# Altium project EnviroSense.PrjPcb (part 2 of 2)

## Sheet WiFi Module.SchDoc: WiFi
size A4; SheetNumber: 5; SheetTotal: 7
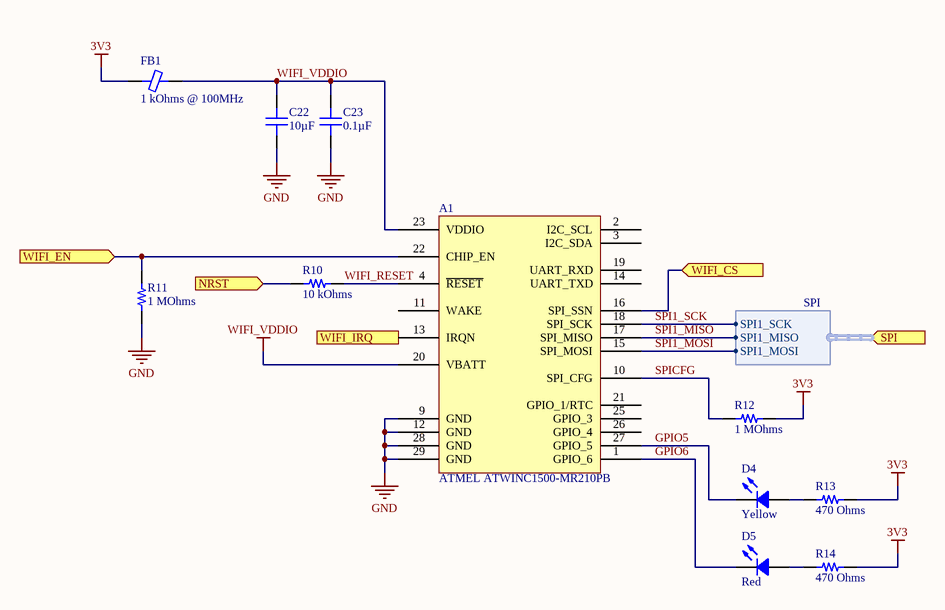
[diagram p4: WiFi Module.SchDoc]

### Parts
A1  ATMEL ATWINC1500-MR210PB  [ATMEL ATWINC1500-MR210PB]
C22  10µF  [CAP 0805_2012]
C23  0.1µF  [CAP 0603_1608]
D4  Yellow  [LED 1206_3216 YELLOW]
D5  Red  [LED 1206_3216 RED]
FB1  1 kOhms @ 100MHz  [FER 0805_2012]
R10  10 kOhms  [RES 0603_1608]
R11  1 MOhms  [RES 0603_1608]
R12  1 MOhms  [RES 0603_1608]
R13  470 Ohms  [RES 0603_1608]
R14  470 Ohms  [RES 0603_1608]

### Ports
NRST (in), SPI (in, harness SPI), WIFI_CS (in), WIFI_EN (in), WIFI_IRQ (out)

### Harnesses
SPI: SPI1_SCK, SPI1_MOSI, SPI1_MISO

### Nets
3V3: FB1.1 R12.2 R13.2 R14.2
GND: A1.9(GND) A1.12(GND) A1.28(GND) A1.29(GND) C22.1 C23.1 R11.1
WIFI_VDDIO: A1.20(VBATT) A1.23(VDDIO) C22.2 C23.2 FB1.2
GPIO5: A1.27(GPIO_5) D4.2
GPIO6: A1.1(GPIO_6) D5.2
NRST: R10.1 ; port NRST
SPI1_MISO: A1.17(SPI_MISO) ; port SPI.SPI1_MISO
SPI1_MOSI: A1.15(SPI_MOSI) ; port SPI.SPI1_MOSI
SPI1_SCK: A1.18(SPI_SCK) ; port SPI.SPI1_SCK
SPICFG: A1.10(SPI_CFG) R12.1
WIFI_CS: A1.16(SPI_SSN) ; port WIFI_CS
WIFI_EN: A1.22(CHIP_EN) R11.2 ; port WIFI_EN
WIFI_IRQ: A1.13(IRQN) ; port WIFI_IRQ
WIFI_RESET: A1.4(~{RESET}) R10.2
NetD4_1: D4.1 R13.1
NetD5_1: D5.1 R14.1

Not connected (* = marked no-connect by the designer): A1 2(I2C_SCL) 3(I2C_SDA) 11(WAKE) 14(UART_TXD) 19(UART_RXD) 21(GPIO_1/RTC) 25(GPIO_3) 26(GPIO_4)

### Notes on the sheet
- Title
- Size:
- Date:
- A4
- Number:
- Time:
- Revision:
- Sheet
- of
- File:

### Library data of the parts
A1 = ATMEL ATWINC1500-MR210PB: System: Connector
C22 = CL21A106KPCLQNC: CAP CER 10UF 10V X5R 0805; Manufacturer: Samsung Electro-Mechanics; Tolerance: ±10%; Part Number: CL21A106KPCLQNC; Value: 10µF; Applications: General Purpose; Capacitance: 10µF; ComponentLink1Description: Datasheet; ComponentLink1URL: http://www.samsungsem.com/kr/support/product-search/mlcc/CL21A106KPCLQNC.jsp; ComponentLink2Description: DigiKey Link; ComponentLink2URL: http://digikey.com/product-detail/en/samsung-electro-mechanics/CL21A106KPCLQNC/1276-2402-1-ND/3890488; Device Package: 0805 (2012 Metric); LastUpdated: 02/09/2020 01:04:19; Lifecycle Status: Active; Minimum Order: 1; Mounting Type: Surface Mount, MLCC; Operating Temperature: -55°C ~ 85°C; Package / Case: 0805 (2012 Metric); Packaging: TapeAndReel; PartId: 14319; Part Status: Active; Price: 0.03; Series: CL; Size / Dimension: 0.079" L x 0.049" W (2.00mm x 1.25mm); Supplier 1: DigiKey; Supplier Part Number 1: 1276-2402-1-ND; Temperature Coefficient: X5R; Thickness (Max): 0.037" (0.95mm); Voltage - Rated: 10V
C23 = 06035C104JAT4A: CAP CER 0.1UF 50V X7R 0603; Manufacturer: AVX Corporation; Tolerance: ±5%; Part Number: 06035C104JAT4A; Value: 0.1µF; Applications: General Purpose; Capacitance: 0.1µF; ComponentLink1Description: Datasheet; ComponentLink1URL: http://datasheets.avx.com/X7RDielectric.pdf; ComponentLink2Description: DigiKey Link; ComponentLink2URL: http://digikey.com/product-detail/en/avx-corporation/06035C104JAT4A/478-12459-1-ND/9749311; Device Package: 0603 (1608 Metric); LastUpdated: 02/09/2020 01:03:34; Lifecycle Status: Active; Minimum Order: 1; Mounting Type: Surface Mount, MLCC; Operating Temperature: -55°C ~ 125°C; Package / Case: 0603 (1608 Metric); Packaging: TapeAndReel; PartId: 3002; Part Status: Active; Price: 0.01; Series: -; Size / Dimension: 0.063" L x 0.032" W (1.60mm x 0.81mm); Supplier 1: DigiKey; Supplier Part Number 1: 478-12459-1-ND; Temperature Coefficient: X7R; Thickness (Max): 0.035" (0.90mm); Voltage - Rated: 50V
D4 = AP3216SYCK: LED YELLOW CLEAR SMD; Manufacturer: Kingbright; Configuration: Standard; Current - Test: 20mA; Lens Color: Colorless; Lens Size: 2.00mm x 1.60mm; Lens Style: Rectangle with Flat Top; Millicandela Rating: 150mcd; Viewing Angle: 120°; Voltage - Forward (Vf) (Typ): 2V; Wavelength - Dominant: 590nm; Part Number: AP3216SYCK; Color: Yellow; ComponentLink1Description: Datasheet; ComponentLink1URL: http://www.kingbrightusa.com/images/catalog/SPEC/AP3216SYCK.pdf; ComponentLink2Description: DigiKey Link; ComponentLink2URL: http://digikey.com/product-detail/en/kingbright/AP3216SYCK/754-2163-1-ND/7708878; Device Package: 1206 (3216 Metric); Height (Max): 1.10mm; LastUpdated: 02/09/2020 01:21:26; Lens Transparency: Clear; Lifecycle Status: Active; Minimum Order: 1; Mounting Type: Surface Mount; Package / Case: 1206 (3216 Metric); Packaging: TapeAndReel; PartId: 5; Part Status: Active; Price: 0.07; Series: -; Size / Dimension: 3.20mm L x 1.60mm W; Supplier 1: DigiKey; Supplier Part Number 1: 754-2163-1-ND; Supplier Device Package: SMD; Value: Yellow; Wavelength - Peak: 590nm
D5 = LTST-C21KRKT: LED RED CLEAR CHIP SMD; Manufacturer: Lite-On Inc.; Configuration: Standard; Current - Test: 20mA; Lens Color: Colorless; Lens Style: Round with Flat Top; Millicandela Rating: 100mcd; Viewing Angle: 70°; Voltage - Forward (Vf) (Typ): 2V; Wavelength - Dominant: 631nm; Wavelength - Peak: 639nm; Part Number: LTST-C21KRKT; Color: Red; ComponentLink1Description: Datasheet; ComponentLink1URL: http://optoelectronics.liteon.com/upload/download/DS22-2006-020/LTST-C21KRKT.pdf; ComponentLink2Description: DigiKey Link; ComponentLink2URL: http://digikey.com/product-detail/en/lite-on-inc/LTST-C21KRKT/160-2024-1-ND/3711415; Device Package: 1206 (3216 Metric); Height (Max): 1.10mm; LastUpdated: 02/09/2020 01:21:09; Lens Transparency: Clear; Lifecycle Status: Active; Minimum Order: 1; Mounting Type: Surface Mount; Package / Case: 1206 (3216 Metric); Packaging: TapeAndReel; PartId: 187; Part Status: Active; Price: 0.07; Series: -; Size / Dimension: 3.20mm L x 1.60mm W; Supplier 1: DigiKey; Supplier Part Number 1: 160-2024-1-ND; Supplier Device Package: Chip LED; Value: Red
FB1 = PE-0805FB102ST: FERRITE BEAD 1 KOHM 0805 1LN; Manufacturer: Pulse Electronics Network; Current Rating (Max): 500mA; DC Resistance (DCR) (Max): 400mOhm; Filter Type: Signal Line; Number of Lines: 1; Part Number: PE-0805FB102ST; ComponentLink1Description: Datasheet; ComponentLink1URL: https://productfinder.pulseeng.com/doc_type/WEB301/doc_num/WC706/doc_part/WC706.pdf; ComponentLink2Description: DigiKey Link; ComponentLink2URL: http://digikey.com/product-detail/en/pulse-electronics-network/PE-0805FB102ST/553-2390-1-ND/5050589; Device Package: 0805 (2012 Metric); Height (Max): 0.041" (1.05mm); Impedance @ Frequency: 1 kOhms @ 100MHz; LastUpdated: 02/09/2020 01:18:21; Lifecycle Status: Active; Minimum Order: 1; Mounting Type: Surface Mount; Operating Temperature: -40°C ~ 105°C; Package / Case: 0805 (2012 Metric); Packaging: TapeAndReel; PartId: 1549; Part Status: Active; Price: 0.02; Series: FB; Size / Dimension: 0.079" L x 0.049" W (2.00mm x 1.25mm); Supplier 1: DigiKey; Supplier Part Number 1: 553-2390-1-ND; Value: 1 kOhms @ 100MHz
R10 = ERJ-PA3J103V: RES SMD 10K OHM 5% 1/4W 0603; Manufacturer: Panasonic Electronic Components; Power (Watts): 0.25W, 1/4W; Temperature Coefficient: ±200ppm/°C; Part Number: ERJ-PA3J103V; Value: 10 kOhms; ComponentLink1Description: Datasheet; ComponentLink1URL: https://industrial.panasonic.com/cdbs/www-data/pdf/RDO0000/AOA0000C331.pdf; ComponentLink2Description: DigiKey Link; ComponentLink2URL: http://digikey.com/product-detail/en/panasonic-electronic-components/ERJ-PA3J103V/P10KBZCT-ND/5036237; Composition: Thick Film; Device Package: 0603 (1608 Metric); Features: Automotive AEC-Q200, Pulse Withstanding; Height - Seated (Max): 0.022" (0.55mm); LastUpdated: 02/09/2020 01:10:16; Lifecycle Status: Active; Minimum Order: 1; Number of Terminations: 2; Operating Temperature: -55°C ~ 155°C; Package / Case: 0603 (1608 Metric); Packaging: TapeAndReel; PartId: 8965; Part Status: Active; Price: 0.01; Ratings: AEC-Q200; Resistance: 10 kOhms; Series: ERJ; Size / Dimension: 0.063" L x 0.031" W (1.60mm x 0.80mm); Supplier 1: DigiKey; Supplier Part Number 1: P10KBZCT-ND; Supplier Device Package: 0603; Tolerance: ±5%
R11 R12 = ERJ-PA3J105V: RES SMD 1M OHM 5% 1/4W 0603; Manufacturer: Panasonic Electronic Components; Power (Watts): 0.25W, 1/4W; Temperature Coefficient: ±200ppm/°C; Part Number: ERJ-PA3J105V; Value: 1 MOhms; ComponentLink1Description: Datasheet; ComponentLink1URL: https://industrial.panasonic.com/cdbs/www-data/pdf/RDO0000/AOA0000C331.pdf; ComponentLink2Description: DigiKey Link; ComponentLink2URL: http://digikey.com/product-detail/en/panasonic-electronic-components/ERJ-PA3J105V/P1MBZCT-ND/5036239; Composition: Thick Film; Device Package: 0603 (1608 Metric); Features: Automotive AEC-Q200, Pulse Withstanding; Height - Seated (Max): 0.022" (0.55mm); LastUpdated: 02/09/2020 01:09:51; Lifecycle Status: Active; Minimum Order: 1; Number of Terminations: 2; Operating Temperature: -55°C ~ 155°C; Package / Case: 0603 (1608 Metric); Packaging: TapeAndReel; PartId: 20407; Part Status: Active; Price: 0.01; Ratings: AEC-Q200; Resistance: 1 MOhms; Series: ERJ; Size / Dimension: 0.063" L x 0.031" W (1.60mm x 0.80mm); Supplier 1: DigiKey; Supplier Part Number 1: P1MBZCT-ND; Supplier Device Package: 0603; Tolerance: ±5%
R13 R14 = CRGCQ0603J470R: CRGCQ 0603 470R 5%; Manufacturer: TE Connectivity Passive Product; Power (Watts): 0.1W, 1/10W; Temperature Coefficient: ±100ppm/°C; Part Number: CRGCQ0603J470R; Value: 470 Ohms; ComponentLink1Description: Datasheet; ComponentLink1URL: https://www.te.com/commerce/DocumentDelivery/DDEController?Action=srchrtrv&DocNm=1773204-3&DocType=DS&DocLang=English; ComponentLink2Description: DigiKey Link; ComponentLink2URL: http://digikey.com/product-detail/en/te-connectivity-passive-product/CRGCQ0603J470R/A130089CT-ND/8577921; Composition: Thick Film; Device Package: 0603 (1608 Metric); Features: Automotive AEC-Q200, Moisture Resistant; Height - Seated (Max): 0.022" (0.55mm); LastUpdated: 02/09/2020 01:09:31; Lifecycle Status: Active; Minimum Order: 1; Number of Terminations: 2; Operating Temperature: -55°C ~ 155°C; Package / Case: 0603 (1608 Metric); Packaging: CutTape; PartId: 25681; Part Status: Active; Price: 0.10; Ratings: AEC-Q200; Resistance: 470 Ohms; Series: CRGCQ; Size / Dimension: 0.063" L x 0.031" W (1.60mm x 0.80mm); Supplier 1: DigiKey; Supplier Part Number 1: A130089CT-ND; Supplier Device Package: 0603; Tolerance: ±5%

## Sheet Environmental Sensor.SchDoc: Environmental Sensor
size A4; SheetNumber: 3; SheetTotal: 7
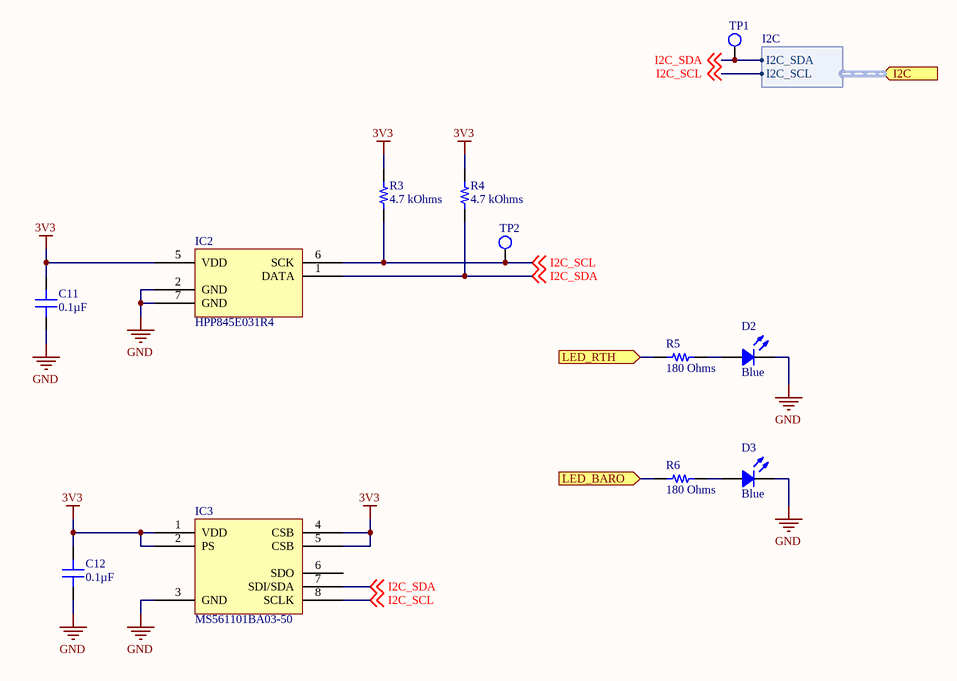
[diagram p5: Environmental Sensor.SchDoc]

### Parts
C11  0.1µF  [CAP 0603_1608]
C12  0.1µF  [CAP 0603_1608]
D2  Blue  [LED 1206_3216 BLUE]
D3  Blue  [LED 1206_3216 BLUE]
IC2  HPP845E031R4  [TE HPP845E031R4]
IC3  MS561101BA03-50  [MEAS SPEC MS5611-01BA03]
R3  4.7 kOhms  [RES 0603_1608]
R4  4.7 kOhms  [RES 0603_1608]
R5  180 Ohms  [RES 0603_1608]
R6  180 Ohms  [RES 0603_1608]
TP1  Test Point  [TestPoint-1.5mm]  (value not drawn)  (no BOM)
TP2  Test Point  [TestPoint-1.5mm]  (value not drawn)  (no BOM)

### Ports
I2C (in, harness I2C), LED_BARO (in), LED_RTH (in)

### Harnesses
I2C: I2C_SDA, I2C_SCL

### Nets
3V3: C11.2 C12.2 IC2.5(VDD) IC3.1(VDD) IC3.2(PS) IC3.4(CSB) IC3.5(CSB) R3.2 R4.2
GND: C11.1 C12.1 D2.2 D3.2 IC2.2(GND) IC2.7(GND) IC3.3(GND)
I2C_SCL: IC2.6(SCK) IC3.8(SCLK) R3.1 TP2.1(TP) ; off-sheet I2C_SCL, port I2C.I2C_SCL
I2C_SDA: IC2.1(DATA) IC3.7(SDI/SDA) R4.1 TP1.1(TP) ; off-sheet I2C_SDA, port I2C.I2C_SDA
LED_BARO: R6.1 ; port LED_BARO
LED_RTH: R5.1 ; port LED_RTH
NetD2_1: D2.1 R5.2
NetD3_1: D3.1 R6.2

Not connected (* = marked no-connect by the designer): IC3 6(SDO)

### Notes on the sheet
- Title
- Size:
- Date:
- A4
- Number:
- Time:
- Revision:
- Sheet
- of
- File:

### Library data of the parts
C11 C12 = 06035C104JAT4A: as C23 on sheet WiFi Module; Part Number: 06035C104JAT4A; Value: 0.1µF; Applications: General Purpose; Capacitance: 0.1µF; ComponentLink1Description: Datasheet; ComponentLink1URL: http://datasheets.avx.com/X7RDielectric.pdf; ComponentLink2Description: DigiKey Link; ComponentLink2URL: http://digikey.com/product-detail/en/avx-corporation/06035C104JAT4A/478-12459-1-ND/9749311; Device Package: 0603 (1608 Metric); LastUpdated: 02/09/2020 01:03:34; Lifecycle Status: Active; Minimum Order: 1; Mounting Type: Surface Mount, MLCC; Operating Temperature: -55°C ~ 125°C; Package / Case: 0603 (1608 Metric); Packaging: TapeAndReel; PartId: 3002; Part Status: Active; Price: 0.01; Series: -; Size / Dimension: 0.063" L x 0.032" W (1.60mm x 0.81mm); Supplier 1: DigiKey; Supplier Part Number 1: 478-12459-1-ND; Temperature Coefficient: X7R; Thickness (Max): 0.035" (0.90mm); Voltage - Rated: 50V
D2 D3 = BL-HB333Q-AV-TRB: 1206 0.5MM BLUE WATER CLEAR SMT; Manufacturer: American Bright Optoelectronics Corporation; Configuration: Standard; Current - Test: 5mA; Lens Color: Colorless; Lens Size: 2.00mm x 1.50mm; Lens Style: Rectangle with Flat Top; Millicandela Rating: 15mcd; Viewing Angle: 120°; Voltage - Forward (Vf) (Typ): 2.8V; Wavelength - Peak: 460nm; Part Number: BL-HB333Q-AV-TRB; Color: Blue; ComponentLink1Description: Datasheet; ComponentLink1URL: //media.digikey.com/pdf/Data%20Sheets/American%20Bright%20Opto%20PDFs/BL-HB333Q-AV-TRB_V1.0_9-29-09.pdf; ComponentLink2Description: DigiKey Link; ComponentLink2URL: http://digikey.com/product-detail/en/american-bright-optoelectronics-corporation/BL-HB333Q-AV-TRB/2007-BL-HB333Q-AV-TRBCT-ND/9924239; Device Package: 1206 (3216 Metric); Height (Max): 0.55mm; LastUpdated: 02/09/2020 01:20:33; Lens Transparency: Clear; Lifecycle Status: Active; Minimum Order: 1; Mounting Type: Surface Mount; Package / Case: 1206 (3216 Metric); Packaging: TapeAndReel; PartId: 746; Part Status: Active; Price: 0.09; Series: -; Size / Dimension: 3.20mm L x 1.60mm W; Supplier 1: DigiKey; Supplier Part Number 1: 2007-BL-HB333Q-AV-TRBCT-ND; Supplier Device Package: 1206; Value: Blue
IC2 = HPP845E031R4: SENSOR HUMID/TEMP 3V I2C 2% SMD; Manufacturer: TE Connectivity Measurement Specialties; Accuracy: ±2% RH; Humidity Range: 0 ~ 100% RH; Output: 12b; Output Type: I²C; Response Time: 5s; Sensor Type: Humidity, Temperature; Voltage - Supply: 1.5V ~ 3.6V; Part Number: HPP845E031R4; ComponentLink1Description: Datasheet; ComponentLink1URL: https://www.te.com/commerce/DocumentDelivery/DDEController?Action=srchrtrv&DocNm=HPC199_6&DocType=Data+Sheet&DocLang=English; ComponentLink2Description: DigiKey Link; ComponentLink2URL: http://digikey.com/product-detail/en/te-connectivity-measurement-specialties/HPP845E031R4/223-1144-1-ND/3945773; Device Package: 6-VDFN Exposed Pad; LastUpdated: 24/05/2020 22:55:13; Lifecycle Status: Active; Minimum Order: 1; Mounting Type: Surface Mount; Operating Temperature: -40°C ~ 125°C; Package / Case: 6-VDFN Exposed Pad; Packaging: TapeAndReel; Part Status: Active; Price: 2.87; Series: HTU; Supplier 1: DigiKey; Supplier Part Number 1: 223-1144-1-ND; Supplier Device Package: 6-DFN (3x3)
IC3 = MS561101BA03-50: BAROMETRIC PRESSURE SENSOR; Manufacturer: TE Connectivity Measurement Specialties; Accuracy: ±0.022PSI (±0.15kPa); Maximum Pressure: 87.02PSI (600kPa); Operating Pressure: 0.15PSI ~ 17.4PSI (1kPa ~ 120kPa); Output: 24 b; Output Type: I²C, SPI; Port Style: No Port; Pressure Type: Absolute; Voltage - Supply: 1.8V ~ 3.6V; Part Number: MS561101BA03-50; Applications: Board Mount; ComponentLink1Description: Datasheet; ComponentLink1URL: https://www.te.com/commerce/DocumentDelivery/DDEController?Action=srchrtrv&DocNm=MS5611-01BA03&DocType=Data+Sheet&DocLang=English; ComponentLink2Description: DigiKey Link; ComponentLink2URL: http://digikey.com/product-detail/en/te-connectivity-measurement-specialties/MS561101BA03-50/223-1622-1-ND/5277638; Device Package: 8-SMD; LastUpdated: 20/04/2020 15:54:53; Lifecycle Status: Active; Minimum Order: 1; Operating Temperature: -40°C ~ 85°C; Package / Case: 8-SMD; Packaging: Unknown; Part Status: Active; Price: 6.37; Series: -; Supplier 1: DigiKey; Supplier Part Number 1: 223-1622-1-ND; Termination Style: SMD (SMT) Tab
R3 R4 = ERJ-3EKF4701V: RES SMD 4.7K OHM 1% 1/10W 0603; Manufacturer: Panasonic Electronic Components; Power (Watts): 0.1W, 1/10W; Temperature Coefficient: ±100ppm/°C; Part Number: ERJ-3EKF4701V; Value: 4.7 kOhms; ComponentLink1Description: Datasheet; ComponentLink1URL: https://industrial.panasonic.com/cdbs/www-data/pdf/RDA0000/AOA0000C304.pdf; ComponentLink2Description: DigiKey Link; ComponentLink2URL: http://digikey.com/product-detail/en/panasonic-electronic-components/ERJ-3EKF4701V/P4.70KHCT-ND/1746782; Composition: Thick Film; Device Package: 0603 (1608 Metric); Features: Automotive AEC-Q200; Height - Seated (Max): 0.022" (0.55mm); LastUpdated: 02/09/2020 01:10:23; Lifecycle Status: Active; Minimum Order: 1; Number of Terminations: 2; Operating Temperature: -55°C ~ 155°C; Package / Case: 0603 (1608 Metric); Packaging: TapeAndReel; PartId: 5645; Part Status: Active; Price: 0.01; Ratings: AEC-Q200; Resistance: 4.7 kOhms; Series: ERJ; Size / Dimension: 0.063" L x 0.031" W (1.60mm x 0.80mm); Supplier 1: DigiKey; Supplier Part Number 1: P4.70KHCT-ND; Supplier Device Package: 0603; Tolerance: ±1%
R5 R6 = ERJ-PA3J181V: RES SMD 180 OHM 5% 1/4W 0603; Manufacturer: Panasonic Electronic Components; Power (Watts): 0.25W, 1/4W; Temperature Coefficient: ±200ppm/°C; Part Number: ERJ-PA3J181V; Value: 180 Ohms; ComponentLink1Description: Datasheet; ComponentLink1URL: https://industrial.panasonic.com/cdbs/www-data/pdf/RDO0000/AOA0000C331.pdf; ComponentLink2Description: DigiKey Link; ComponentLink2URL: http://digikey.com/product-detail/en/panasonic-electronic-components/ERJ-PA3J181V/P180BZCT-ND/5036266; Composition: Thick Film; Device Package: 0603 (1608 Metric); Features: Automotive AEC-Q200, Pulse Withstanding; Height - Seated (Max): 0.022" (0.55mm); LastUpdated: 02/09/2020 01:09:49; Lifecycle Status: Active; Minimum Order: 1; Number of Terminations: 2; Operating Temperature: -55°C ~ 155°C; Package / Case: 0603 (1608 Metric); Packaging: TapeAndReel; PartId: 21551; Part Status: Active; Price: 0.01; Ratings: AEC-Q200; Resistance: 180 Ohms; Series: ERJ; Size / Dimension: 0.063" L x 0.031" W (1.60mm x 0.80mm); Supplier 1: DigiKey; Supplier Part Number 1: P180BZCT-ND; Supplier Device Package: 0603; Tolerance: ±5%

## Sheet Display Module.SchDoc: Display
size A4; SheetNumber: 1; SheetTotal: 7
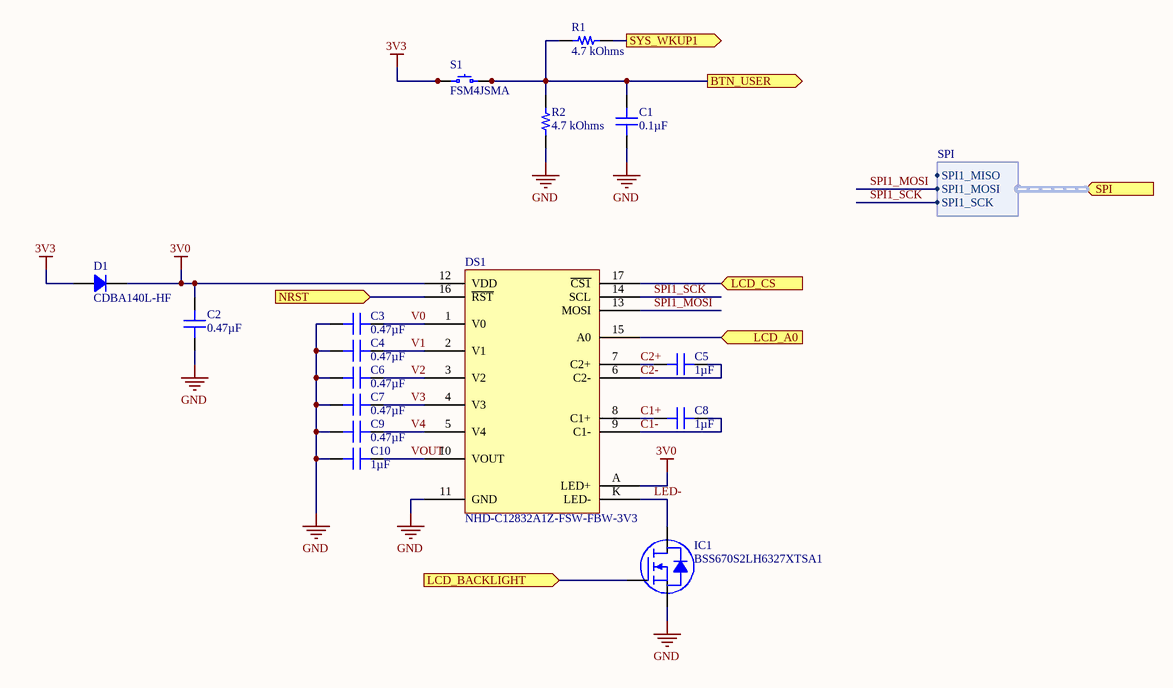
[diagram p6: Display Module.SchDoc]

### Parts
C1  0.1µF  [CAP 0603_1608]
C2  0.47µF  [CAP 0603_1608]
C3  0.47µF  [CAP 0603_1608]
C4  0.47µF  [CAP 0603_1608]
C5  1µF  [CAP 0603_1608]
C6  0.47µF  [CAP 0603_1608]
C7  0.47µF  [CAP 0603_1608]
C8  1µF  [CAP 0603_1608]
C9  0.47µF  [CAP 0603_1608]
C10  1µF  [CAP 0603_1608]
D1  CDBA140L-HF  [DO214AC SMA]
DS1  NHD-C12832A1Z-FSW-FBW-3V3  [NHD-C12832A1Z WHITE]
IC1  BSS670S2LH6327XTSA1  [INFINEON SOT-23-3]
R1  4.7 kOhms  [RES 0603_1608]
R2  4.7 kOhms  [RES 0603_1608]
S1  FSM4JSMA  [TE FSM4JSMA]

### Ports
BTN_USER (out), LCD_A0 (in), LCD_BACKLIGHT (in), LCD_CS (in), NRST (in), SPI (in, harness SPI), SYS_WKUP1 (out)

### Harnesses
SPI: SPI1_MISO, SPI1_MOSI, SPI1_SCK

### Nets
3V0: C2.1 D1.2 DS1.12(VDD) DS1.A(LED+)
3V3: D1.1 S1.1 S1.2
GND: C1.1 C2.2 C3.2 C4.2 C6.2 C7.2 C9.2 C10.1 DS1.11(GND) IC1.2(S) R2.1
BTN_USER: C1.2 R1.2 R2.2 S1.3 S1.4 ; port BTN_USER
C1+: C8.1 DS1.8(C1+)
C1-: C8.2 DS1.9(C1-)
C2+: C5.1 DS1.7(C2+)
C2-: C5.2 DS1.6(C2-)
LCD_A0: DS1.15(A0) ; port LCD_A0
LCD_BACKLIGHT: IC1.1(G) ; port LCD_BACKLIGHT
LCD_CS: DS1.17(~{CS1}) ; port LCD_CS
LED-: DS1.K(LED-) IC1.3(D)
NRST: DS1.16(~{RST}) ; port NRST
SPI1_MOSI: DS1.13(MOSI) ; port SPI.SPI1_MOSI
SPI1_SCK: DS1.14(SCL) ; port SPI.SPI1_SCK
SYS_WKUP1: R1.1 ; port SYS_WKUP1
V0: C3.1 DS1.1(V0)
V1: C4.1 DS1.2(V1)
V2: C6.1 DS1.3(V2)
V3: C7.1 DS1.4(V3)
V4: C9.1 DS1.5(V4)
VOUT: C10.2 DS1.10(VOUT)

### Notes on the sheet
- Title
- Size:
- Date:
- A4
- Number:
- Time:
- Revision:
- Sheet
- of
- File:

### Library data of the parts
C1 = 06035C104JAT4A: as C23 on sheet WiFi Module; Part Number: 06035C104JAT4A; Value: 0.1µF; Applications: General Purpose; Capacitance: 0.1µF; ComponentLink1Description: Datasheet; ComponentLink1URL: http://datasheets.avx.com/X7RDielectric.pdf; ComponentLink2Description: DigiKey Link; ComponentLink2URL: http://digikey.com/product-detail/en/avx-corporation/06035C104JAT4A/478-12459-1-ND/9749311; Device Package: 0603 (1608 Metric); LastUpdated: 02/09/2020 01:03:34; Lifecycle Status: Active; Minimum Order: 1; Mounting Type: Surface Mount, MLCC; Operating Temperature: -55°C ~ 125°C; Package / Case: 0603 (1608 Metric); Packaging: TapeAndReel; PartId: 3002; Part Status: Active; Price: 0.01; Series: -; Size / Dimension: 0.063" L x 0.032" W (1.60mm x 0.81mm); Supplier 1: DigiKey; Supplier Part Number 1: 478-12459-1-ND; Temperature Coefficient: X7R; Thickness (Max): 0.035" (0.90mm); Voltage - Rated: 50V
C2-C4 C6 C7 C9 = 0603B474K100CT: CAP CER 0.47UF 10V X7R 0603; Manufacturer: Walsin Technology Corporation; Tolerance: ±10%; Part Number: 0603B474K100CT; Value: 0.47µF; Applications: General Purpose; Capacitance: 0.47µF; ComponentLink1Description: Datasheet; ComponentLink1URL: http://www.passivecomponent.com/wp-content/uploads/2018/10/MLCC.pdf; ComponentLink2Description: DigiKey Link; ComponentLink2URL: http://digikey.com/product-detail/en/walsin-technology-corporation/0603B474K100CT/1292-1450-1-ND/9355454; Device Package: 0603 (1608 Metric); LastUpdated: 02/09/2020 01:03:16; Lifecycle Status: Active; Minimum Order: 1; Mounting Type: Surface Mount, MLCC; Operating Temperature: -55°C ~ 125°C; Package / Case: 0603 (1608 Metric); Packaging: TapeAndReel; PartId: 13392; Part Status: Active; Price: 0.01; Series: -; Size / Dimension: 0.063" L x 0.031" W (1.60mm x 0.80mm); Supplier 1: DigiKey; Supplier Part Number 1: 1292-1450-1-ND; Temperature Coefficient: X7R; Thickness (Max): 0.037" (0.95mm); Voltage - Rated: 10V
C5 C8 C10 = LMK107B7105KA-T: CAP CER 1UF 10V X7R 0603; Manufacturer: Taiyo Yuden; Tolerance: ±10%; Part Number: LMK107B7105KA-T; Value: 1µF; Applications: General Purpose; Capacitance: 1µF; ComponentLink1Description: Datasheet; ComponentLink1URL: https://www.yuden.co.jp/productdata/catalog/mlcc01_e.pdf; ComponentLink2Description: DigiKey Link; ComponentLink2URL: http://digikey.com/product-detail/en/taiyo-yuden/LMK107B7105KA-T/587-1242-1-ND/931019; Device Package: 0603 (1608 Metric); LastUpdated: 02/09/2020 01:03:30; Lifecycle Status: Active; Minimum Order: 1; Mounting Type: Surface Mount, MLCC; Operating Temperature: -55°C ~ 125°C; Package / Case: 0603 (1608 Metric); Packaging: TapeAndReel; PartId: 5525; Part Status: Active; Price: 0.01; Series: M; Size / Dimension: 0.063" L x 0.031" W (1.60mm x 0.80mm); Supplier 1: DigiKey; Supplier Part Number 1: 587-1242-1-ND; Temperature Coefficient: X7R; Thickness (Max): 0.035" (0.90mm); Voltage - Rated: 10V
D1 = CDBA140L-HF: DIODE SCHOTTKY 40V 1A DO214AC; Manufacturer: Comchip Technology; Capacitance @ Vr, F: 130pF @ 4V, 1MHz; Current - Reverse Leakage @ Vr: 1mA @ 40V; Speed: Fast Recovery =< 500ns, > 200mA (Io); Voltage - Forward (Vf) (Max) @ If: 400mV @ 1A; Part Number: CDBA140L-HF; ComponentLink1Description: Datasheet; ComponentLink1URL: http://www.comchiptech.com/admin/files/product/CDBA140L-HF RevC513944.pdf; ComponentLink2Description: DigiKey Link; ComponentLink2URL: http://digikey.com/product-detail/en/comchip-technology/CDBA140L-HF/641-1691-1-ND/5226074; Current - Average Rectified (Io): 1A; Diode Type: Schottky; LastUpdated: 02/09/2020 01:19:02; Lifecycle Status: Active; Minimum Order: 1; Mounting Type: Surface Mount; Operating Temperature - Junction: -50°C ~ 100°C; Package / Case: DO-214AC, SMA; Packaging: TapeAndReel; PartId: 2148; Part Status: Active; Price: 0.10; Series: -; Supplier 1: DigiKey; Supplier Part Number 1: 641-1691-1-ND; Supplier Device Package: DO-214AC (SMA); Voltage - DC Reverse (Vr) (Max): 40V
DS1 = NHD-C12832A1Z-FSW-FBW-3V3: LCD COG GRAPHIC 128X32; Manufacturer: Newhaven Display Intl; Background Color: White (Black - Inverted); Backlight: LED - White; Display Mode: Transflective; Display Type: FSTN - Film Super-Twisted Nematic; Interface: SPI; Viewing Area: 36.00mm W x 12.00mm H; Part Number: NHD-C12832A1Z-FSW-FBW-3V3; ComponentLink1Description: Datasheet; ComponentLink1URL: http://www.newhavendisplay.com/specs/NHD-C12832A1Z-FSW-FBW-3V3.pdf; ComponentLink2Description: DigiKey Link; ComponentLink2URL: //digikey.com/product-detail/en/newhaven-display-intl/NHD-C12832A1Z-FSW-FBW-3V3/NHD-C12832A1Z-FSW-FBW-3V3-ND/2059236; LastUpdated: 04/12/2019 12:49:03; Lifecycle Status: 0; Minimum Order: 1; Packaging: Unknown; PartId: 1; Part Status: Active; Price: 11.53; Series: -; Supplier 1: DigiKey; Supplier Part Number 1: NHD-C12832A1Z-FSW-FBW-3V3-ND
IC1 = BSS670S2LH6327XTSA1: MOSFET N-CH 55V 540MA SOT23; Manufacturer: Infineon Technologies; Current - Continuous Drain (Id) @ 25°C: 540mA (Ta); Drive Voltage (Max Rds On,  Min Rds On): 4.5V, 10V; FET Type: N-Channel; Gate Charge (Qg) (Max) @ Vgs: 2.26nC @ 10V; Input Capacitance (Ciss) (Max) @ Vds: 75pF @ 25V; Power Dissipation (Max): 360mW (Ta); Rds On (Max) @ Id, Vgs: 650mOhm @ 270mA, 10V; Vgs (Max): ±20V; Vgs(th) (Max) @ Id: 2V @ 2.7µA; Part Number: BSS670S2LH6327XTSA1; ComponentLink1Description: Datasheet; ComponentLink1URL: https://www.infineon.com/dgdl/BSS670S2L_Rev2.5.pdf?folderId=db3a3043156fd573011622e10b5c1f67&fileId=db3a304330f68606013109e4a7fb0094; ComponentLink2Description: DigiKey Link; ComponentLink2URL: http://digikey.com/product-detail/en/infineon-technologies/BSS670S2LH6327XTSA1/BSS670S2LH6327XTSA1CT-ND/3196653; Drain to Source Voltage (Vdss): 55V; LastUpdated: 02/09/2020 01:25:05; Lifecycle Status: Active; Minimum Order: 1; Mounting Type: Surface Mount; Operating Temperature: -55°C ~ 150°C (TJ); Package / Case: TO-236-3, SC-59, SOT-23-3; Packaging: TapeAndReel; Part Status: Active; Price: 0.07; Series: OptiMOS™; Supplier 1: DigiKey; Supplier Part Number 1: BSS670S2LH6327XTSA1CT-ND; Supplier Device Package: SOT-23-3; Technology: MOSFET (Metal Oxide)
R1 R2 = ERJ-3EKF4701V: as R3 on sheet Environmental Sensor; Part Number: ERJ-3EKF4701V; Value: 4.7 kOhms; ComponentLink1Description: Datasheet; ComponentLink1URL: https://industrial.panasonic.com/cdbs/www-data/pdf/RDA0000/AOA0000C304.pdf; ComponentLink2Description: DigiKey Link; ComponentLink2URL: http://digikey.com/product-detail/en/panasonic-electronic-components/ERJ-3EKF4701V/P4.70KHCT-ND/1746782; Composition: Thick Film; Device Package: 0603 (1608 Metric); Features: Automotive AEC-Q200; Height - Seated (Max): 0.022" (0.55mm); LastUpdated: 02/09/2020 01:10:23; Lifecycle Status: Active; Minimum Order: 1; Number of Terminations: 2; Operating Temperature: -55°C ~ 155°C; Package / Case: 0603 (1608 Metric); Packaging: TapeAndReel; PartId: 5645; Part Status: Active; Price: 0.01; Ratings: AEC-Q200; Resistance: 4.7 kOhms; Series: ERJ; Size / Dimension: 0.063" L x 0.031" W (1.60mm x 0.80mm); Supplier 1: DigiKey; Supplier Part Number 1: P4.70KHCT-ND; Supplier Device Package: 0603; Tolerance: ±1%
S1 = FSM4JSMA: SWITCH TACTILE SPST-NO 0.05A 24V; Manufacturer: TE Connectivity ALCOSWITCH Switches; Actuator Height off PCB, Vertical: 5.00mm; Actuator Orientation: Top Actuated; Actuator Type: Standard; Contact Rating @ Voltage: 0.05A @ 24VDC; Illumination: Non-Illuminated; Operating Force: 160gf; Outline: 6.00mm x 6.00mm; Switch Function: Off-Mom; Part Number: FSM4JSMA; Circuit: SPST-NO; ComponentLink1Description: Datasheet; ComponentLink1URL: https://www.te.com/commerce/DocumentDelivery/DDEController?Action=srchrtrv&DocNm=1308111-1_SWITCHES_CORE_PROGRAM_CATALOG&DocType=CS&DocLang=English; ComponentLink2Description: DigiKey Link; ComponentLink2URL: http://digikey.com/product-detail/en/te-connectivity-alcoswitch-switches/FSM4JSMA/450-1129-ND/525821; LastUpdated: 02/09/2020 01:27:07; Lifecycle Status: Active; Minimum Order: 1; Mounting Type: Surface Mount; Operating Temperature: -35°C ~ 85°C; Packaging: Bulk; Part Status: Active; Price: 0.23; Series: FSMJSMA; Supplier 1: DigiKey; Supplier Part Number 1: 450-1129-ND; Termination Style: Gull Wing

## Nets that join several sheets
3V3: Microcontroller (15 pins), Voltage Regulation (C28.2 C29.2 IC6.1 R21.1), WiFi Module (FB1.1 R12.2 R13.2 R14.2), Environmental Sensor (9 pins), Display Module (D1.1 S1.1 S1.2)
GND: Microcontroller (19 pins), Battery Charger (15 pins), Voltage Regulation (8 pins), WiFi Module (7 pins), Environmental Sensor (7 pins), Display Module (11 pins)
VBATT: Battery Charger (5 pins), Voltage Regulation (S5.3)
BATT_VOLT: Microcontroller (IC4.7), Battery Charger (R15.1 R16.2)
BTN_USER: Microcontroller (IC4.29), Display Module (5 pins)
I2C_SCL: Microcontroller (IC4.19), Environmental Sensor (IC2.6 IC3.8 R3.1 TP2.1)
I2C_SDA: Microcontroller (IC4.20), Environmental Sensor (IC2.1 IC3.7 R4.1 TP1.1)
LCD_A0: Microcontroller (IC4.16), Display Module (DS1.15)
LCD_BACKLIGHT: Microcontroller (IC4.26), Display Module (IC1.1)
LCD_CS: Microcontroller (IC4.15), Display Module (DS1.17)
LED_BARO: Microcontroller (IC4.28), Environmental Sensor (R6.1)
LED_RTH: Microcontroller (IC4.27), Environmental Sensor (R5.1)
NRST: Microcontroller (5 pins), WiFi Module (R10.1), Display Module (DS1.16)
SPI1_MISO: Microcontroller (IC4.12 J1.4), WiFi Module (A1.17)
SPI1_MOSI: Microcontroller (IC4.13 J1.3), WiFi Module (A1.15), Display Module (DS1.13)
SPI1_SCK: Microcontroller (IC4.11 J1.2), WiFi Module (A1.18), Display Module (DS1.14)
SYS_WKUP1: Microcontroller (IC4.6), Display Module (R1.1)
WIFI_CS: Microcontroller (IC4.14), WiFi Module (A1.16)
WIFI_EN: Microcontroller (IC4.21), WiFi Module (A1.22 R11.2)
WIFI_IRQ: Microcontroller (IC4.22), WiFi Module (A1.13)